# EAGLE design v2.0 Main (EAGLE 7.7.0)

## Sheet 1 of 2
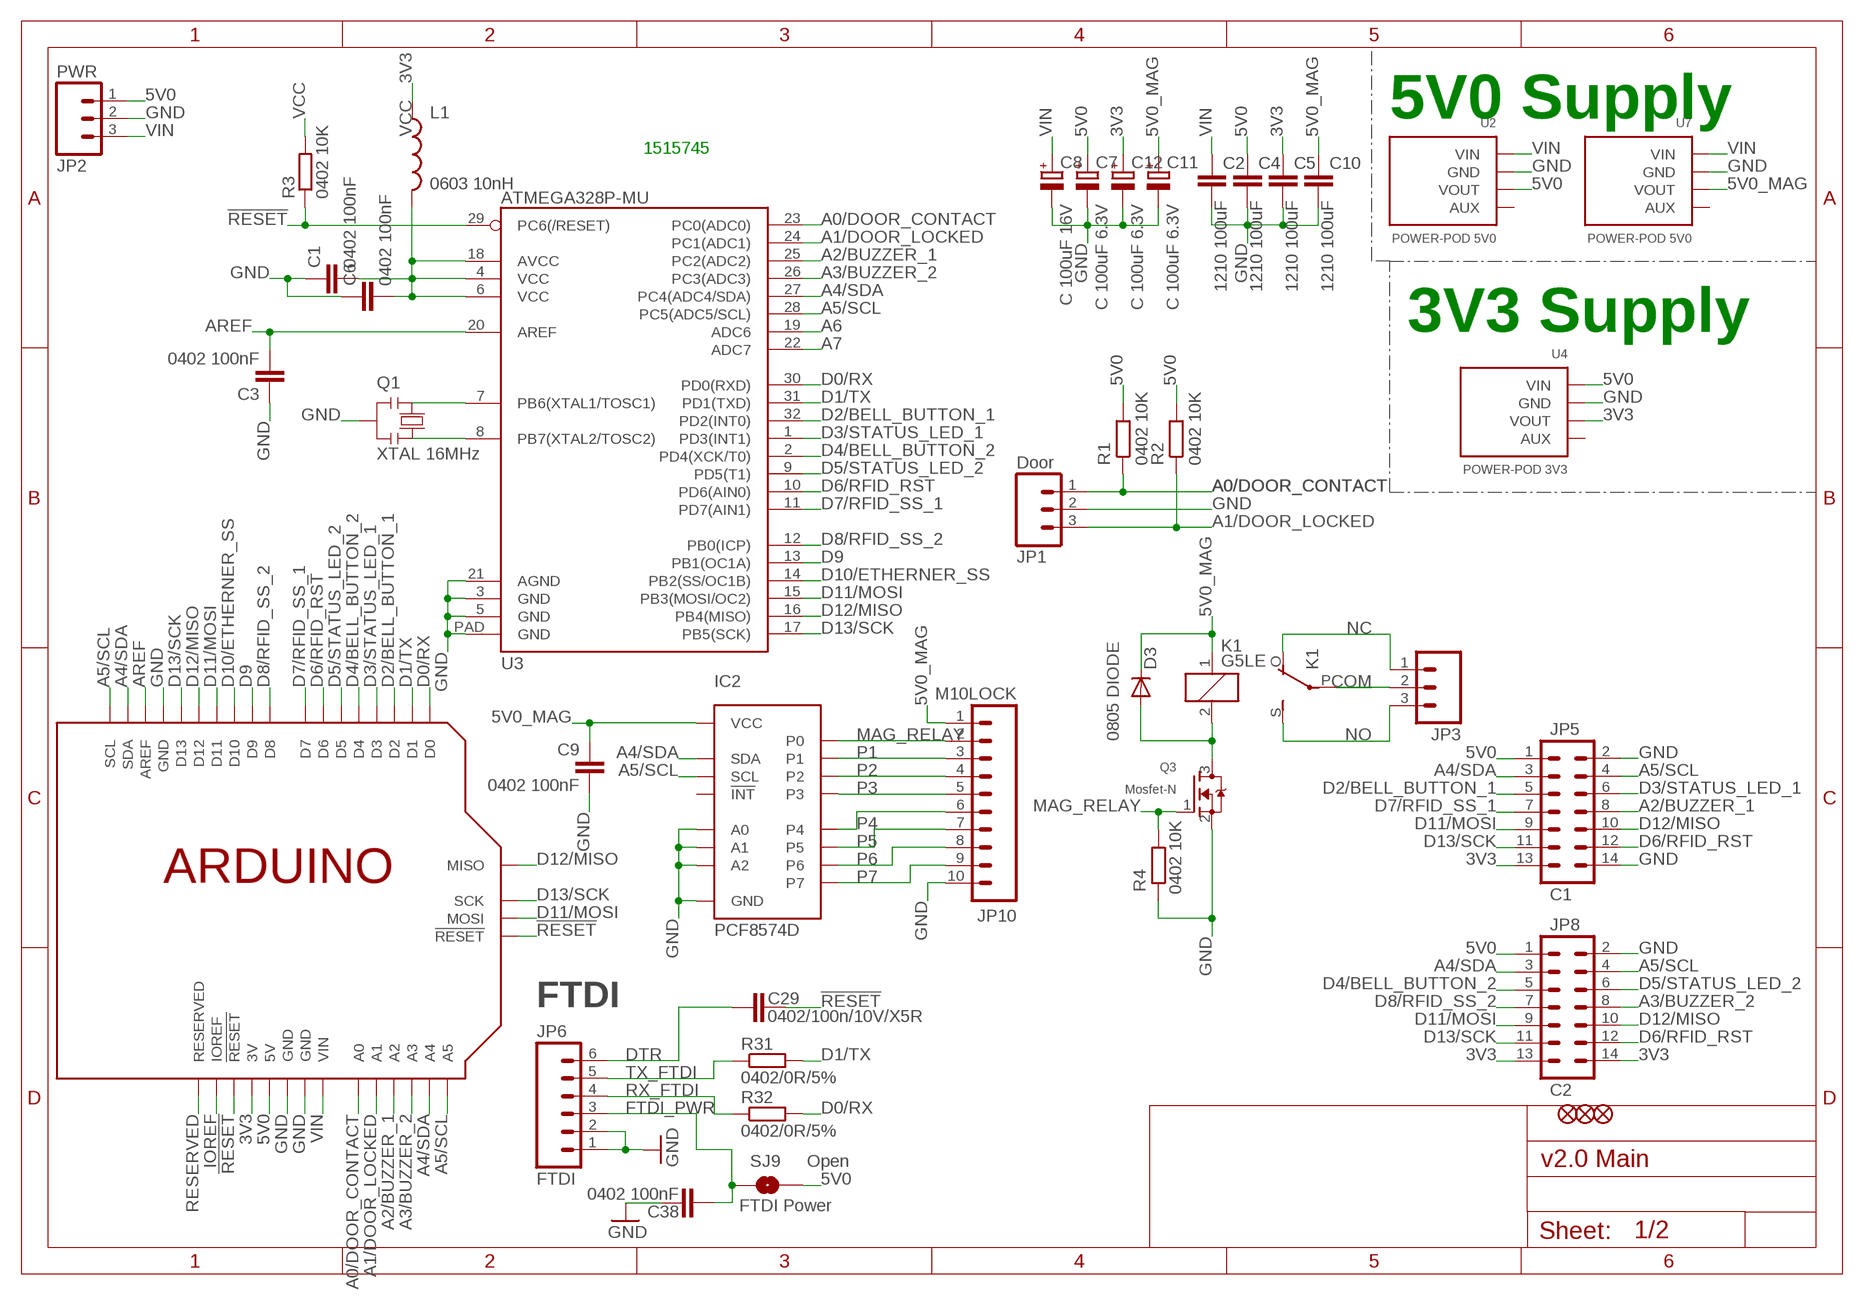
[diagram p0: schematic, sheet 1]

### Parts
C1  0402 100nF  C-EUC0402-SMALLER  [C0402-SMALLER]
C2  1210 100uF  C-EUC1210  [C1210]
C3  0402 100nF  C-EUC0402-SMALLER  [C0402-SMALLER]
C4  1210 100uF  C-EUC1210  [C1210]
C5  1210 100uF  C-EUC1210  [C1210]
C6  0402 100nF  C-EUC0402-SMALLER  [C0402-SMALLER]
C7  C 100uF 6.3V  CPOL-EUC  [PANASONIC_C]
C8  C 100uF 16V  CPOL-EUC  [PANASONIC_C]
C9  0402 100nF  C-EUC0402-SMALLER  [C0402-SMALLER]
C10  1210 100uF  C-EUC1210  [C1210]
C11  C 100uF 6.3V  CPOL-EUC  [PANASONIC_C]
C12  C 100uF 6.3V  CPOL-EUC  [PANASONIC_C]
C29  0402/100n/10V/X5R  C-EUC0402-ARDUINO-ROUND  [C0402-ARDUINO-ROUND]
C38  0402 100nF  C-EUC0402-SMALLER  [C0402-SMALLER]
D3  0805 DIODE  DIODE-0805  [0805-DIODE]
IC2  PCF8574D  PCF8574  [SO16]
JP1  Door  M03-SCREW-5MM  [SCREWTERMINAL-5MM-3]
JP2  PWR  M03-SCREW-5MM  [SCREWTERMINAL-5MM-3]
JP3  M03-SCREW-5MM  [SCREWTERMINAL-5MM-3]
JP4  FIDUCIAL1X2.5-STOP  [FIDUCIAL-1X2.5-STOP]
JP5  C1  M07X2-SHOROUDED_LOCK  [2X7-SHROUDED_LOCK]
JP6  FTDI  M06SIP  [1X06]
JP7  FIDUCIAL1X2.5-STOP  [FIDUCIAL-1X2.5-STOP]
JP8  C2  M07X2-SHOROUDED_LOCK  [2X7-SHROUDED_LOCK]
JP9  FIDUCIAL1X2.5-STOP  [FIDUCIAL-1X2.5-STOP]
JP10  M10LOCK  [1X10_LOCK]
K1  G5LE  G5LE-NO_TSOP-SMALL  [G5LE-NOSTOP-SMALL]
L1  0603 10nH  INDUCTOR0603K-SMALL  [C0603K-SMALL]
Q1  XTAL 16MHz  RESONATORMU  [RESONATOR]
Q3  Mosfet-N  MOSFET-N-SOT23-SPARK  [SOT23-3]
R1  0402 10K  R-EU_R0402-SMALLER  [R0402-SMALLER]
R2  0402 10K  R-EU_R0402-SMALLER  [R0402-SMALLER]
R3  0402 10K  R-EU_R0402-SMALLER  [R0402-SMALLER]
R4  0402 10K  R-EU_R0402-SMALLER  [R0402-SMALLER]
R31  0402/0R/5%  R-EU_R0402-ARDUINO-ROUND  [R0402-ARDUINO-ROUND]
R32  0402/0R/5%  R-EU_R0402-ARDUINO-ROUND  [R0402-ARDUINO-ROUND]
SJ9  FTDI Power  SOLDERJUMPERTRACE  [SJ_2S-TRACE]
U1  ARDUINOSPI-REFRENCE  [ARDUINOR3-LWKTXT-REF-SPI]
U2  POWER-POD 5V0  POWER-POD  [POWER-POD-LANDING]
U3  ATMEGA328P-MU  ATMEGA328-MLF-SHORT  [MLF32-SHORT-CREAM]
U4  POWER-POD 3V3  POWER-POD  [POWER-POD-LANDING]
U7  POWER-POD 5V0  POWER-POD  [POWER-POD-LANDING]

### Nets
3V3: C5.1 C12.+ JP5.13 JP8.13 JP8.14 L1.1 U1.3V U4.3(VOUT)
5V0: C4.1 C7.+ JP2.1 JP5.1 JP8.1 R1.2 R2.2 SJ9.2 U1.5V U1.5V@ISP(5V) U2.3(VOUT) U4.1(VIN)
5V0_MAG: C9.1 C10.1 C11.+ D3.C IC2.16(VCC) JP10.1 K1.1 U7.3(VOUT)
!RESET: C29.1 R3.1 U1.!RESET U1.!RESET@ISP(!RESET) U3.29(PC6(/RESET))
A0/DOOR_CONTACT: JP1.1 R1.1 U1.A0 U3.23(PC0(ADC0)) ; also sheet 2
A1/DOOR_LOCKED: JP1.3 R2.1 U1.A1 U3.24(PC1(ADC1)) ; also sheet 2
A2/BUZZER_1: JP5.8 U1.A2 U3.25(PC2(ADC2))
A3/BUZZER_2: JP8.8 U1.A3 U3.26(PC3(ADC3))
A4/SDA: IC2.15(SDA) JP5.3 JP8.3 U1.A4 U1.SDA U3.27(PC4(ADC4/SDA))
A5/SCL: IC2.14(SCL) JP5.4 JP8.4 U1.A5 U1.SCL U3.28(PC5(ADC5/SCL))
A6: U3.19(ADC6)
A7: U3.22(ADC7)
AREF: C3.2 U1.AREF U3.20(AREF)
COM: JP3.2 K1.P(2:P)
D0/RX: R32.2 U1.D0 U3.30(PD0(RXD))
D1/TX: R31.2 U1.D1 U3.31(PD1(TXD))
D2/BELL_BUTTON_1: JP5.5 U1.D2 U3.32(PD2(INT0))
D3/STATUS_LED_1: JP5.6 U1.D3 U3.1(PD3(INT1))
D4/BELL_BUTTON_2: JP8.5 U1.D4 U3.2(PD4(XCK/T0))
D5/STATUS_LED_2: JP8.6 U1.D5 U3.9(PD5(T1))
D6/RFID_RST: JP5.12 JP8.12 U1.D6 U3.10(PD6(AIN0))
D7/RFID_SS_1: JP5.7 U1.D7 U3.11(PD7(AIN1))
D8/RFID_SS_2: JP8.7 U1.D8 U3.12(PB0(ICP))
D9: U1.D9 U3.13(PB1(OC1A))
D10/ETHERNER_SS: U1.D10 U3.14(PB2(SS/OC1B))
D11/MOSI: JP5.9 JP8.9 U1.D11 U1.MOSI U3.15(PB3(MOSI/OC2))
D12/MISO: JP5.10 JP8.10 U1.D12 U1.MISO U3.16(PB4(MISO))
D13/SCK: JP5.11 JP8.11 U1.D13 U1.SCK U3.17(PB5(SCK))
DTR: C29.2 JP6.6
FTDI_PWR: C38.2 JP6.3 SJ9.1
GND: C1.1 C2.2 C3.1 C4.2 C5.2 C6.1 C7.- C8.- C9.2 C10.2 C11.- C12.- C38.1 IC2.1(A0) IC2.2(A1) IC2.3(A2) IC2.8(GND) JP1.2 JP2.2 JP5.2 JP5.14 JP6.1 JP6.2 JP8.2 JP10.10 Q1.2 Q3.2(S) R4.1 U1.GND@1(GND) U1.GND@2(GND) U1.GND@3(GND) U1.GND@ISP(GND) U2.2(GND) U3.3(GND) U3.5(GND) U3.21(AGND) U3.PAD(GND) U4.2(GND) U7.2(GND) ; also sheet 2
IOREF: U1.IOREF
MAG_RELAY: IC2.4(P0) JP10.2 Q3.1(G) R4.2
N$2: D3.A K1.2 Q3.3(D)
N$3: Q1.1 U3.7(PB6(XTAL1/TOSC1))
N$4: Q1.3 U3.8(PB7(XTAL2/TOSC2))
NC: JP3.1 K1.O(2:O)
NO: JP3.3 K1.S(2:S)
P1: IC2.5(P1) JP10.3
P2: IC2.6(P2) JP10.4
P3: IC2.7(P3) JP10.5
P4: IC2.9(P4) JP10.6
P5: IC2.10(P5) JP10.7
P6: IC2.11(P6) JP10.8
P7: IC2.12(P7) JP10.9
RESERVED: U1.RESERVED
RX_FTDI: JP6.4 R32.1
TX_FTDI: JP6.5 R31.1
VCC: C1.2 C6.2 L1.2 R3.2 U3.4(VCC) U3.6(VCC) U3.18(AVCC)
VIN: C2.1 C8.+ JP2.3 U1.VIN U2.1(VIN) U7.1(VIN)
Unconnected: IC2.13(!INT) U2.4(AUX) U4.4(AUX) U7.4(AUX)

### Notes on the sheet
- 5V0 Supply
- 1515745
- 3V3 Supply
- FTDI
- Open

## Sheet 2 of 2
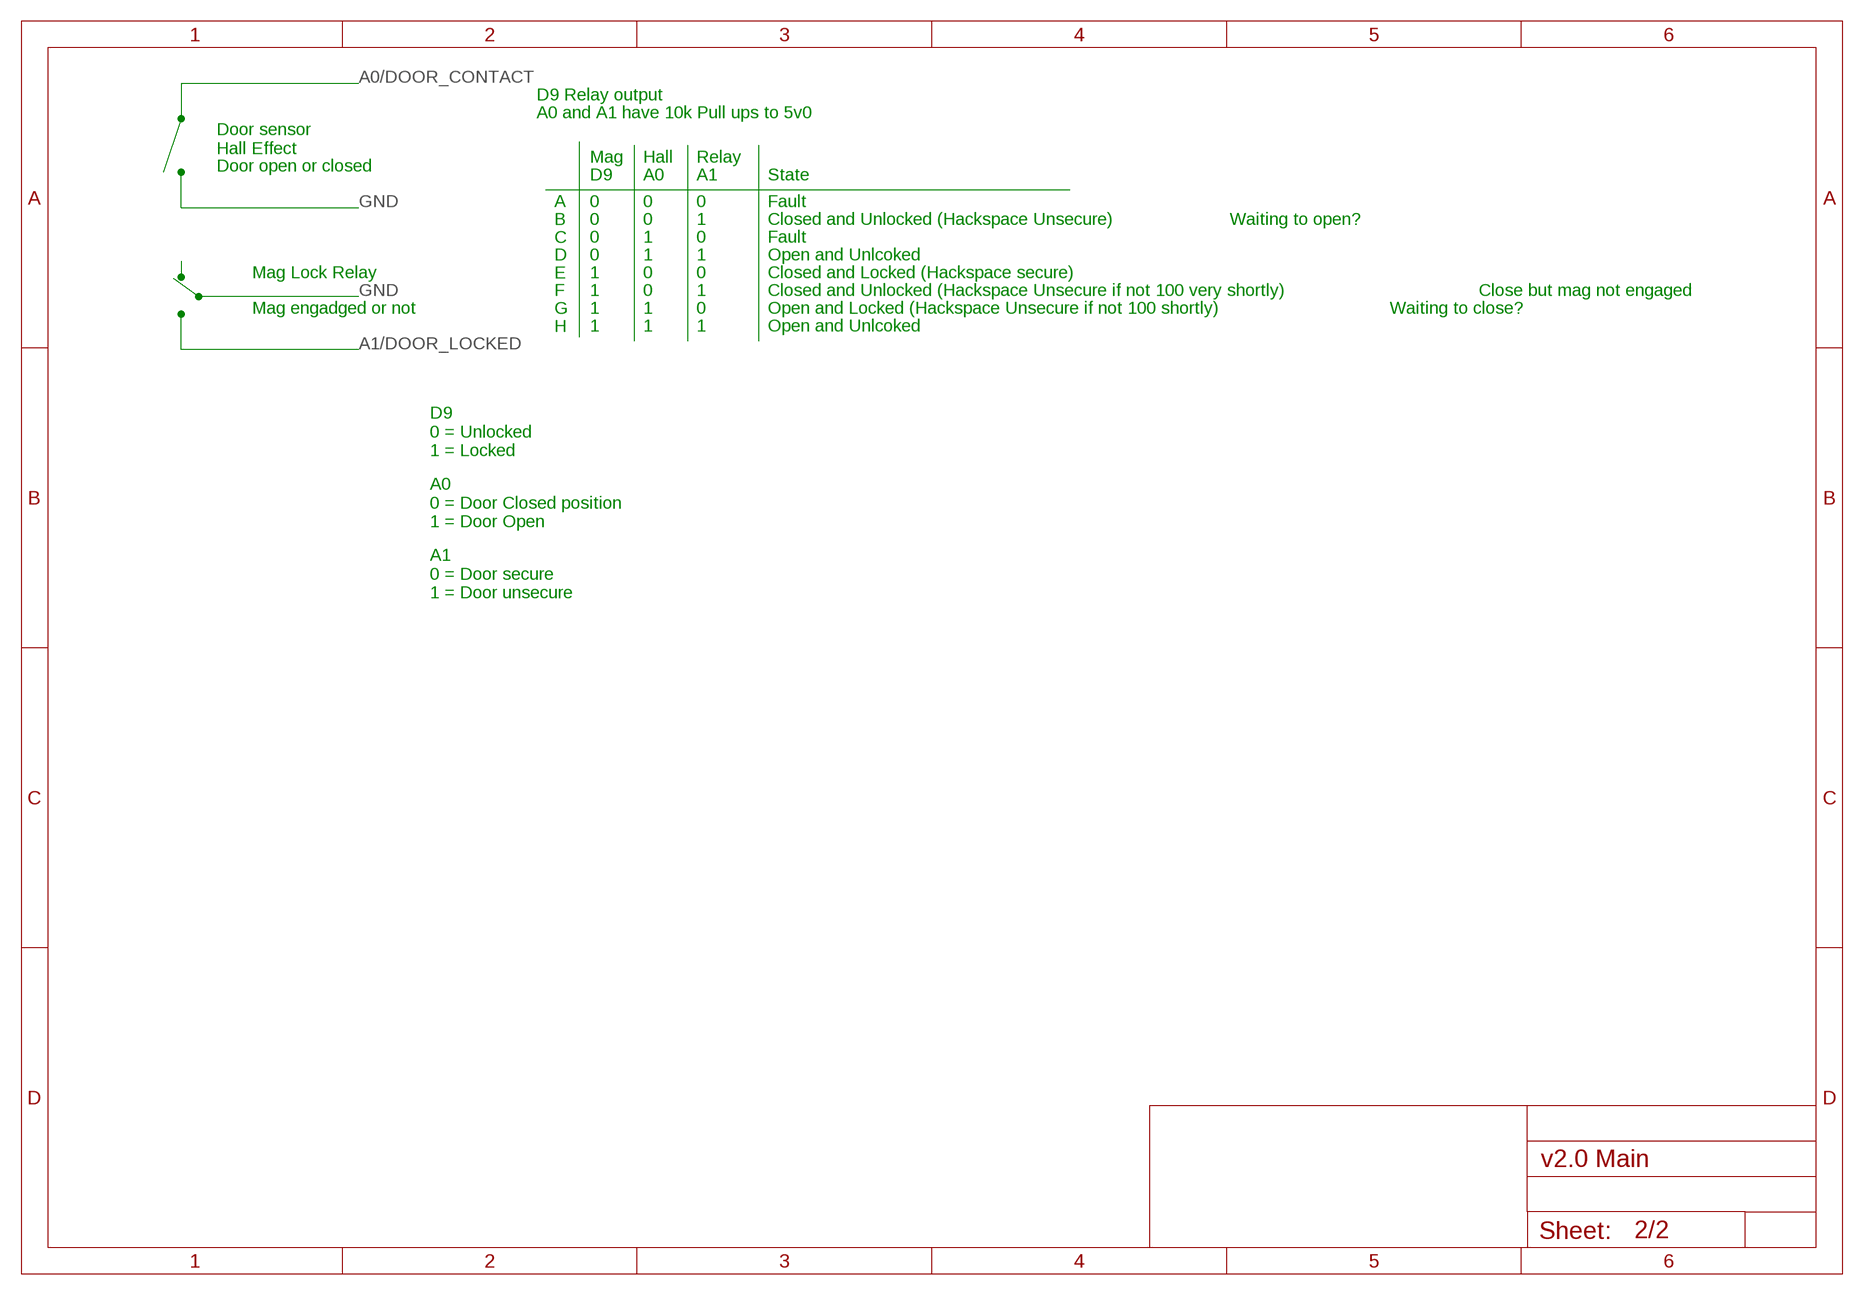
[diagram p1: schematic, sheet 2]

### Notes on the sheet
- D9 Relay output
- A0 and A1 have 10k Pull ups to 5v0
- Door sensor
  Hall Effect
- Mag | Hall | Relay
- Door open or closed
- D9 | A0 | A1 | State
- 0 | 0 | 0 | Fault
- 0 | 0 | 1 | Closed and Unlocked (Hackspace Unsecure) | Waiting to open?
- 0 | 1 | 0 | Fault
- 0 | 1 | 1 | Open and Unlcoked
- Mag Lock Relay | 1 | 0 | 0 | Closed and Locked (Hackspace secure)
- 1 | 0 | 1 | Closed and Unlocked (Hackspace Unsecure if not 100 very shortly) | Close but mag not engaged
- Mag engadged or not | 1 | 1 | 0 | Open and Locked (Hackspace Unsecure if not 100 shortly) | Waiting to close?
- A
  B
  C
  D
  E
  F
  G
  H
- 1 | 1 | 1 | Open and Unlcoked
- D9
  0 = Unlocked
  1 = Locked
- A0
  0 = Door Closed position
  1 = Door Open
- A1
  0 = Door secure
  1 = Door unsecure

## Library data of the parts
C1-C6 C9 C10 = CISECO eaglecad designs:C-EU: CAPACITOR, European symbol
C7 C8 C11 C12 = rcl:CPOL-EU: POLARIZED CAPACITOR, European symbol
C29 C38 = TiLDA Mk2 Parts:C-EU: CAPACITOR, European symbol
D3 = CISECO eaglecad designs:DIODE-: DIODE
IC2 = CISECO eaglecad designs:PCF8574
JP1-JP3 = CISECO eaglecad designs:M03: Header 3 Standard 3-pin 0.1" header. Use with straight break away headers (SKU : PRT-00116), right angle break away headers (PRT-00553), swiss pins (PRT-00743), machine pins (PRT-00117), and female headers (PRT-00115). Molex polarized connector foot print use with SKU : PRT-08232 with associated crimp pins and housings.
JP4 JP7 JP9 = CISECO eaglecad designs:FIDUCIAL: Fiducial Alignment Points Various fiducial points for machine vision alignment.
JP5 JP8 = CISECO eaglecad designs:M07X2
JP6 = TiLDA Mk2 Parts:M06: Header 6 Standard 6-pin 0.1" header. Use with straight break away headers (SKU : PRT-00116), right angle break away headers (PRT-00553), swiss pins (PRT-00743), machine pins (PRT-00117), and female headers (PRT-00115). Molex polarized connector foot print use with SKU : PRT-08094 with associated crimp pins and housings. NOTES ON THE VARIANTS LOCK and LOCK_LONGPADS... This footprint was designed to help hold the alignment of a through-hole component (i.e. 6-pin header) while soldering it into place. You may notice that each hole has been shifted either up or down by 0.005 of an inch from it's more standard position (which is a perfectly straight line). This slight alteration caused the pins (the squares in the middle) to touch the edges of the holes. Because they are alternating, it causes a "brace" to hold the component in place. 0.005 has proven to be the perfect amount of "off-center" position when using our standard breakaway headers. Although looks a little odd when you look at the bare footprint, once you have a header in there, the alteration is very hard to notice. Also, if you push a header all the way into place, it is covered up entirely on the bottom side. This idea of altering the position of holes to aid alignment will be further integrated into the Sparkfun Library for other footprints. It can help hold any component with 3 or more connection pins.
JP10 = CISECO eaglecad designs:M10: Header 10 Standard 10-pin 0.1" header. Use with straight break away headers (SKU : PRT-00116), right angle break away headers (PRT-00553), swiss pins (PRT-00743), machine pins (PRT-00117), and female headers (PRT-00115).
K1 = CISECO eaglecad designs:G5LE: RELAY 1 x switch, 10 A/120 V AC, 8 A/30 V DC, Omron
L1 = CISECO eaglecad designs:INDUCTOR: Inductors Basic Inductor/Choke - 0603 and 1206. Footprints are not proven and vary greatly between part numbers.
Q1 = MySMD2:RESONATOR
Q3 = TiLDA Mk2 Parts:MOSFET-N: N-Channel Mosfet 2N7002E - 60V 260mA SOT23 [Digikey: 2N7002ET1GOSTR-ND] - REEL BSH103 - 30V 850mA SOT23 [Digikey: 568-5013-1-ND]
R1-R4 = CISECO eaglecad designs:R-EU_: RESISTOR, European symbol
R31 R32 = TiLDA Mk2 Parts:R-EU_: RESISTOR, European symbol
SJ9 = TiLDA Mk2 Parts:SOLDERJUMPER: Solder Jumper Standard SMD solder jumper. Used to automate production. Two varients : Normally Open and Normally Closed are the same, but have different paste layers. NC will have a large amount of paste and should jumper during reflow.
U1 = CISECO eaglecad designs:ARDUINOSPI
U2 U4 U7 = Ciseco Footprints:POWER-POD
U3 = CISECO eaglecad designs:ATMEGA328-MLF

## Net classes
2 MAINS: clearance 4 mm

## Board
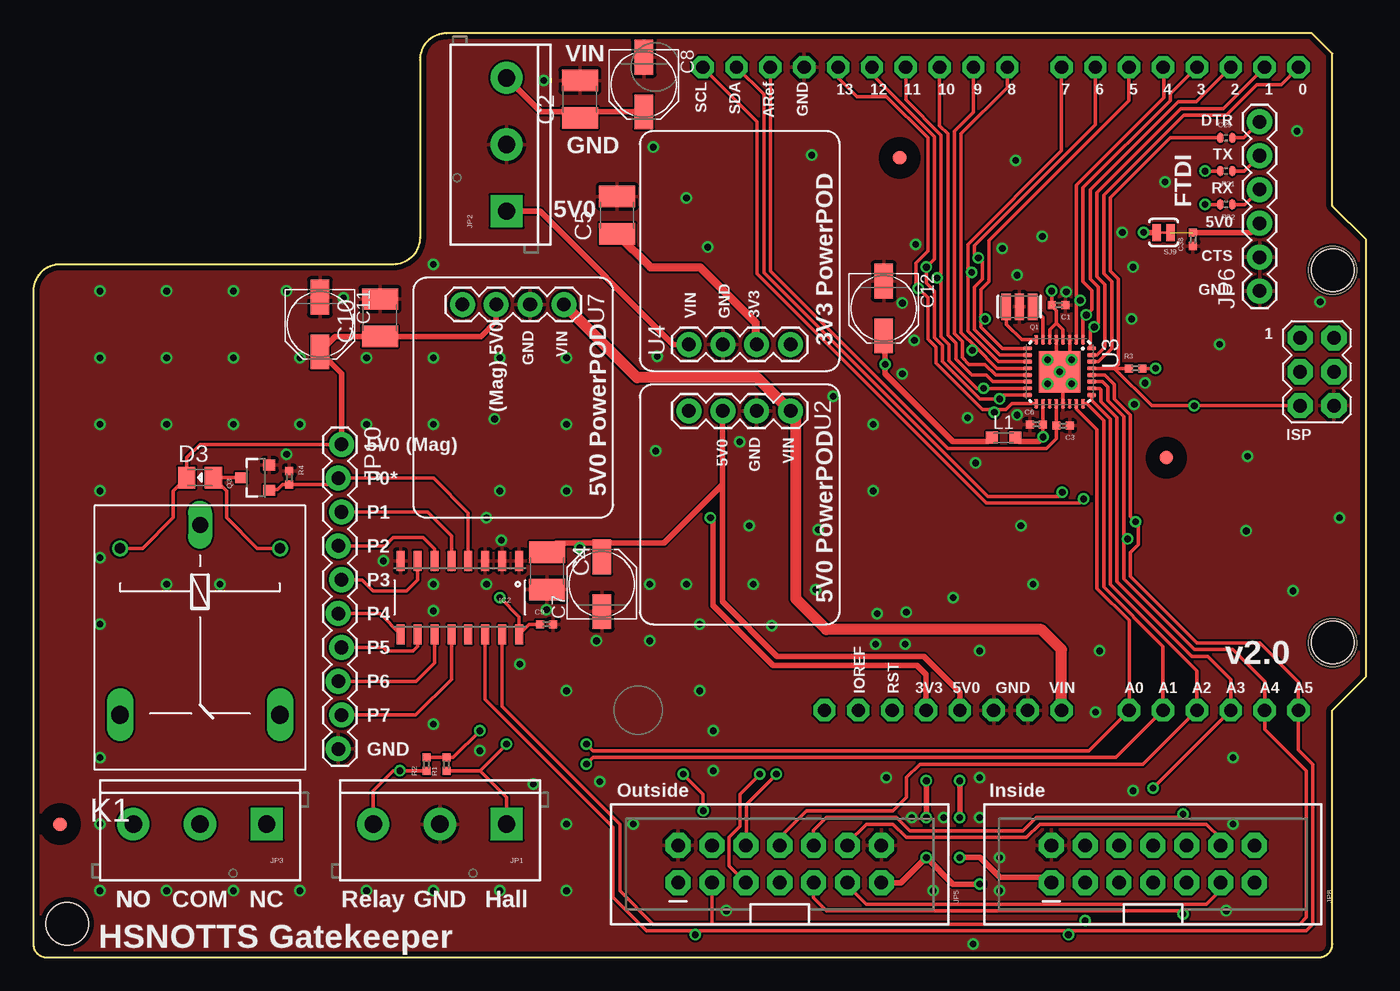
[diagram p2: board, top side]
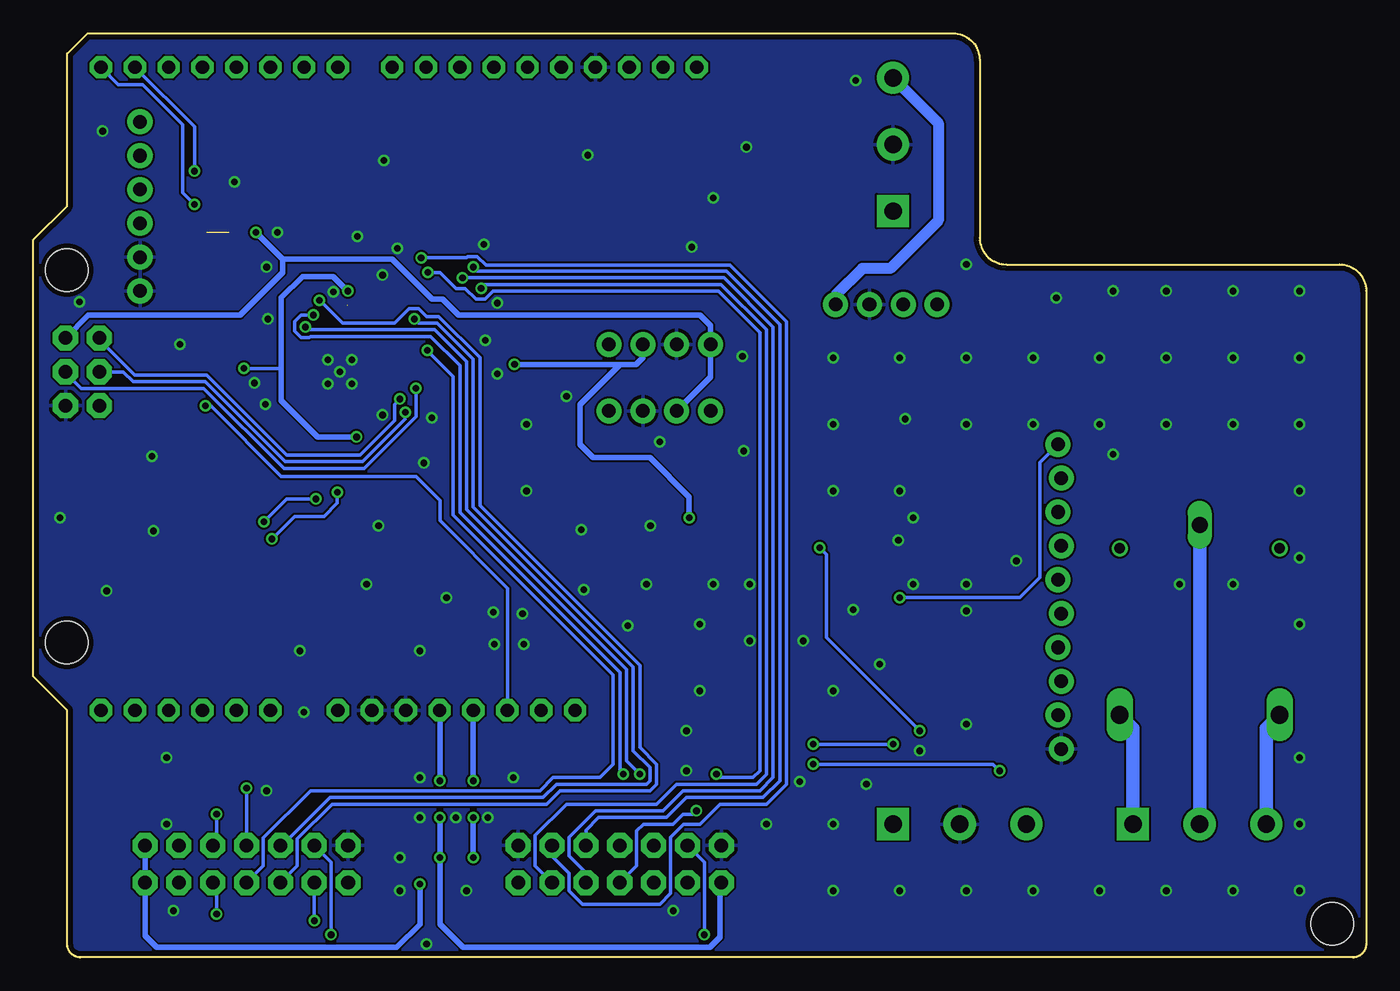
[diagram p3: board, bottom side, seen from below]

Size 100 x 69.34 mm. Coordinates in mm from the lower left corner, seen from the top.
Outline: 95.94,69.34 31,69.34 arc90 29,67.34 29,54 arc-90 27,52 2,52 arc90 0,50 0,1 arc90 1,0 96.46,0 arc90 97.46,1 97.46,18.54 100,21.08 100,53.85 97.46,56.39 97.46,67.82 95.94,69.34
Copper layers (1*16): Top 0.0356mm / dielectric 1.5011mm / Bottom 0.0356mm
Design rules "default *": minimum track width 6mil, minimum drill 13mil, track to track 6mil, track to pad 6mil, pad to pad 6mil, via to via 6mil, smd to smd 6mil, copper to edge 15mil, drill to drill 6mil, minimum pad ring 7mil, minimum via ring 7mil, stop-mask expansion 3mil, vias tented up to drill 23mil, thermal gap 10mil
Holes 3.2 mm at 2.54,2.54 97.48,51.56 97.48,23.62

### Footprints (pad centres in the part's own frame; a part is rotated, then mirrored left to right if it is on the bottom)
C0402-SMALLER = smd 0.6 x 0.6: 1 -0.5,0; 2 0.5,0
C1210 = smd 1.6 x 2.7: 1 -1.4,0; 2 1.4,0
PANASONIC_C = smd 2.6 x 1.4: + 2.05,0; - -2.05,0
C0402-ARDUINO-ROUND = smd 0.508 x 0.762: 1 -0.445,0; 2 0.445,0
0805-DIODE = smd 1.3 x 1.6: A 1,0; C -1,0
SO16 = smd 0.6 x 1.5: 1 -4.445,-2.75; 2 -3.175,-2.75; 3 -1.905,-2.75; 4 -0.635,-2.75; 5 0.635,-2.75; 6 1.905,-2.75; 7 3.175,-2.75; 8 4.445,-2.75; 9 4.445,2.75; 10 3.175,2.75; 11 1.905,2.75; 12 0.635,2.75; 13 -0.635,2.75; 14 -1.905,2.75; 15 -3.175,2.75; 16 -4.445,2.75
SCREWTERMINAL-5MM-3 = drill 1.3 pad 2.413 square: 1 0,0 | drill 1.3 pad 2.413: 2 5,0; 3 10,0
FIDUCIAL-1X2.5-STOP = smd 1 x 1: 1 0,0
2X7-SHROUDED_LOCK = drill 1.016 pad 1.88 octagon: 1 -7.62,-1.397; 2 -7.62,1.397; 3 -5.08,-1.397; 4 -5.08,1.397; 5 -2.54,-1.397; 6 -2.54,1.397; 7 0,-1.397; 8 0,1.397; 9 2.54,-1.397; 10 2.54,1.397; 11 5.08,-1.397; 12 5.08,1.397; 13 7.62,-1.397; 14 7.62,1.397
1X06 = drill 1.016 pad 1.88: 1 0,0; 2 2.54,0; 3 5.08,0; 4 7.62,0; 5 10.16,0; 6 12.7,0
1X10_LOCK = drill 1.016 pad 1.88: 1 0,0.127; 2 2.54,-0.127; 3 5.08,0.127; 4 7.62,-0.127; 5 10.16,0.127; 6 12.7,-0.127; 7 15.24,0.127; 8 17.78,-0.127; 9 20.32,0.127; 10 22.86,-0.127
G5LE-NOSTOP-SMALL = drill 0.8: 1 -7.7,-6; 2 -7.7,6 | drill 1.321 long: O 4.8,6; S 4.8,-6 | drill 1.2 long: P -9.45,0
C0603K-SMALL = smd 0.889 x 0.889: 1 -0.875,0; 2 0.875,0
RESONATOR = smd 0.7 x 2: 1 -1,0; 2 0,0; 3 1,0
SOT23-3 = smd 0.8 x 0.9: 1 -0.95,-1; 2 0.95,-1; 3 0,1.1
R0402-SMALLER = smd 0.6 x 0.6: 1 -0.5,0; 2 0.5,0
R0402-ARDUINO-ROUND = smd 0.508 x 0.762: 1 -0.445,0; 2 0.445,0
SJ_2S-TRACE = smd 0.635 x 1.27: 1 -0.508,0; 2 0.508,0
ARDUINOR3-LWKTXT-REF-SPI = drill 1 pad 1.676 octagon: 3V 35.56,2.54; 5V 38.1,2.54; !RESET 33.02,2.54; A0 50.8,2.54; A1 53.34,2.54; A2 55.88,2.54; A3 58.42,2.54; A4 60.96,2.54; A5 63.5,2.54; AREF 23.876,50.8; D0 63.5,50.8; D1 60.96,50.8; D2 58.42,50.8; D3 55.88,50.8; D4 53.34,50.8; D5 50.8,50.8; D6 48.26,50.8; D7 45.72,50.8; D8 41.656,50.8; D9 39.116,50.8; D10 36.576,50.8; D11 34.036,50.8; D12 31.496,50.8; D13 28.956,50.8; GND@1 43.18,2.54; GND@2 40.64,2.54; GND@3 26.416,50.8; IOREF 30.48,2.54; RESERVED 27.94,2.54; SCL 18.796,50.8; SDA 21.336,50.8; VIN 45.72,2.54 | drill 1.016 pad 1.88 octagon: 5V@ISP 66.167,30.48; !RESET@ISP 63.627,25.4; GND@ISP 66.167,25.4; MISO 63.627,30.48; MOSI 66.167,27.94; SCK 63.627,27.94
POWER-POD-LANDING = drill 1.016 pad 1.88: 1 -3.81,0; 2 -1.27,0; 3 1.27,0; 4 3.81,0
MLF32-SHORT-CREAM = smd 0.7 x 0.28: 1 -2.4,1.75; 2 -2.4,1.25; 3 -2.4,0.75; 4 -2.4,0.25; 5 -2.4,-0.25; 6 -2.4,-0.75; 7 -2.4,-1.25; 8 -2.4,-1.75; 17 2.4,-1.75; 18 2.4,-1.25; 19 2.4,-0.75; 20 2.4,-0.25; 21 2.4,0.25; 22 2.4,0.75; 23 2.4,1.25; 24 2.4,1.75 | smd 0.28 x 0.7: 9 -1.75,-2.4; 10 -1.25,-2.4; 11 -0.75,-2.4; 12 -0.25,-2.4; 13 0.25,-2.4; 14 0.75,-2.4; 15 1.25,-2.4; 16 1.75,-2.4; 25 1.75,2.4; 26 1.25,2.4; 27 0.75,2.4; 28 0.25,2.4; 29 -0.25,2.4; 30 -0.75,2.4; 31 -1.25,2.4; 32 -1.75,2.4 | smd 3.1 x 3.1: PAD 0,0

### Placement (x,y rotation side)
C1  76.93,48.94 180 top
C2  41,64.4 90 top
C3  77.25,39.9 180 top
C4  38.55,29 270 top
C5  43.8,55.7 90 top
C6  75.25,40 0 top
C7  42.65,28 90 top
C8  45.8,65.5 270 top
C9  38.5,25 0 top
C10  26,48 90 top
C11  21.5,47.5 270 top
C12  63.8,48.7 270 top
C29  89.5,61.5 0 top
C38  87,53.88 90 top
D3  12.5,36 0 top
IC2  32,27 180 top
JP1  35.5,10 180 top
JP2  35.5,56 90 top
JP3  17.5,10 180 top
JP4  2,10 0 top
JP5  56,7 0 top
JP6  92,50 90 top
JP7  65,60 0 top
JP8  84,7 0 top
JP9  85,37.5 0 top
JP10  23,38.5 270 top
K1  12.5,23 270 top
L1  72.8,39 0 top
Q1  73.98,48.83 180 top
Q3  16.7,36 90 top
R1  31,14.5 90 top
R2  29.5,14.5 90 top
R3  82.7,44.2 0 top
R4  19.2,36 270 top
R31  89.5,59 180 top
R32  89.5,56.5 180 top
SJ9  84.8,54.4 180 top
U1  31.42,16 0 top
U2  53,41 180 top
U3  77,43.95 270 top
U4  53,46 0 top
U7  36,49 180 top

### Tracks (layer width: path | path; a pad name or v marks a point on that pad's centre or on a via)
3V3  (via drill 0.5)
  Top 0.406: U1.3V 66.98,21.22 66.3,21.9 55.5,21.9 51,26.4 51,32.8 v50.8,33 | C12.+ 63.9,46.65 v63.9,44.5 63.9,43.8 69,38.7 71.62,38.7 L1.1 | v67,13.25 v67,10.5 | JP5.13 65.1,5.6 65.65,6.15 65.23,5.73 v67,7.5 69,5.5 v71,5.5
  Top 0.61: U4.3 54.2,46.07 54.2,47.6 50.02,51.78 46.3,51.78 43.8,54.28 C5.1
  Bottom 0.406: v50.8,33 50.8,34.55 53.75,37.5 58,37.5 59,38.5 59,41.5 56,44.5 | U4.3 54.27,45 54.77,44.5 56,44.5 | 56,44.5 v63.9,44.5 | U1.3V 67,18.52 v67,13.25 | v67,10.5 v67,7.5 | v71,5.5 71,2.5 72.75,0.75 90.75,0.75 91.62,1.62 JP8.13 JP8.14
5V0  (via drill 0.5)
  Top 0.254: R2.2 R1.2 31.5,15 v33.5,17 | v41,30.75 41,31.1
  Top 0.406: U1.5V 69.52,19.88 66.8,22.6 55.8,22.6 51.7,26.7 51.7,35.5 | 51.7,35.5 51.7,41 U2.3 | 42.65,31.1 41,31.1 39.25,31.1 C4.1 | 42.65,31.1 47.3,31.1 51.7,35.5 | v83.3,54.4 SJ9.2 | C7.+ 42.65,31.1 | JP2.1 38,56 48,46 U4.1 | v69.5,13.25 v69.5,10.5 | JP8.1 75.98,6 72.5,6 71,7.5 v69.5,7.5
  Bottom 0.254: v33.5,17 40.5,24 40.5,30.25 v41,30.75
  Bottom 0.406: U2.3 49.19,43.54 U4.1 49.2,47.4 50,48.2 68.1,48.2 69.3,49.4 70.1,49.4 73.1,52.4 81.3,52.4 | U1.5V@ISP 95.87,48.2 84.5,48.2 81.3,51.4 81.3,52.4 | 81.3,52.4 v83.3,54.4 | U1.5V 69.5,18.52 v69.5,13.25 | v69.5,10.5 v69.5,7.5 69.5,2.5 67.75,0.75 49.25,0.75 48.5,1.5 48.5,5.48 JP5.1
5V0_MAG  (via drill 0.5)
  Top 0.254: K1.1 8.2,30.7 10.5,33 10.5,35 D3.C 11.5,37.5 12.5,38.5 JP10.1 | v35,27 36.45,25.55 IC2.16 37.2,25 C9.1
  Top 0.406: U7.3 34.73,47.73 33.6,46.6 C10.1 22.65,46.6 C11.+ 23.13,43.82 JP10.1
  Bottom 0.254: v35,27 26,27 24.5,28.5 24.5,37.13 JP10.1
!RESET  (via drill 0.5)
  Top 0.254: C29.1 85.3,61.5 80.8,57 80.8,51.5 81.4,50.9 81.4,44.5 81.1,44.2 | 81.1,44.2 R3.1 | 81.1,44.2 U3.29 | U1.!RESET@ISP v87.1,41.4 83.9,41.4 81.1,44.2
  Bottom 0.254: U1.!RESET 64.4,18.58 64.4,27.7 69.5,32.8 69.5,34.3 71.3,36.1 81.4,36.1 86.7,41.4 v87.1,41.4
A0/DOOR_CONTACT  (via drill 0.5)
  Top 0.254: U3.23 78.25,41.15 79.8,39.6 79.8,27.7 82.22,25.28 U1.A0 79.18,15.5 42,15.5 v41.5,16 | JP1.1 35.5,12 33.5,14 | 33.5,14 R1.1 | v35.5,16 33.5,14
  Bottom 0.254: v41.5,16 v35.5,16
A1/DOOR_LOCKED  (via drill 0.5)
  Top 0.254: U3.24 79.05,41.55 80.3,40.3 80.3,27.8 84.76,23.34 U1.A1 81.22,15 42,15 v41.5,14.5 | JP1.3 25.5,12.5 27,14 v27.5,14 R2.1
  Bottom 0.254: v41.5,14.5 28,14.5 v27.5,14
A2/BUZZER_1
  Top 0.254: U3.25 79.4,41.8 80.8,40.4 80.8,28 87.3,21.5 U1.A2 83.26,14.5 66.5,14.5 65.5,13.5 65.5,12 64.5,11 58,11 56,9 JP5.8
A3/BUZZER_2  (via drill 0.5)
  Top 0.254: U3.26 80,42.7 80.1,42.6 80.1,41.7 81.3,40.5 81.3,28.2 86.9,22.6 88.1,22.6 89.84,20.86 U1.A3 v84,12.7
  Bottom 0.254: v84,12.7 JP8.8
A4/SDA  (via drill 0.5)
  Top 0.254: 81.8,31.4 81.8,40.6 80.6,41.8 80.6,42.8 80.2,43.2 U3.27 | 81.8,31.4 81.8,28.4 87.1,23.1 90,23.1 92.38,20.72 U1.A4 92.38,17.12 95.5,14 95.5,3 95,2.5 78.92,2.5 | v82.1,31.4 81.8,31.4 | U1.SDA 54.8,64.76 54.8,51.4 71.6,34.6 76.9,34.6 v77.2,34.9 | IC2.15 35.17,18.82 44,10 44,5 46.5,2.5 50.93,2.5 | 78.92,2.5 50.93,2.5 | v78.92,2.75 78.92,2.5 | JP5.3 50.92,2.51 50.93,2.5
  Bottom 0.254: v77.2,34.9 77.2,34.1 78.2,33.1 80.4,33.1 v82.1,31.4 | JP8.3 v78.92,2.75
A5/SCL  (via drill 0.5)
  Top 0.254: U3.28 80.4,43.7 81.1,43 81.1,41.9 82.3,40.7 82.3,33.1 v82.7,32.7 82.9,32.5 82.9,31 82.3,30.4 82.3,28.6 87.3,23.6 92,23.6 94.92,20.68 U1.A5 94.92,15.58 96,14.5 96,2.5 95.5,2 77.66,2 | U1.SCL 54.3,62.72 54.3,51.3 71.5,34.1 78.5,34.1 v78.8,34.4 | IC2.14 33.91,19.34 43.5,9.75 43.5,4.5 46,2 49.66,2 | 77.66,2 49.66,2 | v49.66,1.7 49.66,2 | v77.66,1.7 77.66,2
  Bottom 0.254: v78.8,34.4 81,34.4 v82.7,32.7 | JP5.4 49.66,7.13 49.66,6.73 49.66,7.01 v49.66,1.7 | JP8.4 77.66,7.14 77.66,5.52 77.66,7.01 v77.66,1.7
AREF
  Top 0.254: U1.AREF 55.3,51.5 68.6,38.2 76,38.2 76.75,38.95 C3.2 U3.20
COM
  Bottom 1.016: K1.P JP3.2
D0/RX  (via drill 0.5)
  Top 0.254: U1.D0 93.62,65.5 91.8,65.5 89.5,63.2 86.3,63.2 80.3,57.2 80.3,51.3 80.9,50.7 80.9,45.7 79.9,44.7 U3.30 | R32.2 v87.9,56.5
  Bottom 0.254: v87.9,56.5 88.8,57.4 88.8,62.5 91.8,65.5 93.62,65.5 U1.D0
D1/TX  (via drill 0.5)
  Top 0.254: U1.D1 89.28,63.7 86.1,63.7 79.8,57.4 79.8,51.1 80.4,50.5 80.4,45.8 79.8,45.2 U3.31 | R31.2 v87.9,59
  Bottom 0.254: v87.9,59 87.9,62.32 U1.D1
D2/BELL_BUTTON_1  (via drill 0.5)
  Top 0.254: U1.D2 87.24,64.2 85.9,64.2 79.3,57.6 79.3,50.9 79.9,50.3 79.9,47.6 v79.6,47.3 79.3,47.3 79.3,45.8 U3.32 | JP5.5 52.2,6.87 52.2,7.37 52.2,6.99 52.2,9.02 53,9.82 53,12.25 v54.5,13.75
  Bottom 0.254: v79.6,47.3 79.4,47.1 69.9,47.1 67.5,44.7 67.5,33.6 55.5,21.6 55.5,14.75 v54.5,13.75
D3/STATUS_LED_1  (via drill 0.5)
  Top 0.254: U3.1 78.75,48.2 v79,48.2 79.4,48.6 79.4,50.05 78.75,50.7 78.75,57.75 85.3,64.3 85.3,64.8 U1.D3 | v55.75,13.75 53.5,11.5 53.5,8.44 JP5.6
  Bottom 0.254: v79,48.2 79.9,48.2 80.4,47.7 80.4,47 79.9,46.5 79.3,46.5 79.2,46.6 70.2,46.6 68,44.4 68,33.4 56,21.4 56,14 v55.75,13.75
D4/BELL_BUTTON_2  (via drill 0.5)
  Top 0.254: U1.D4 84.8,66.76 84.8,64.5 78.25,57.95 78.25,49.3 | U3.2 78.25,49.3 | 78.25,49.3 v78.55,49.3
  Bottom 0.254: v78.55,49.3 78.5,49.3 76.8,47.6 72.9,47.6 71.8,48.7 71.1,48.7 70.5,48.1 69.6,48.1 66.5,45 66.5,33.9 54.5,21.9 54.5,15.75 53.25,14.5 53.25,13 53.75,12.5 60.5,12.5 61.5,11.5 77.59,11.5 80.2,8.89 80.2,6.99 80.2,7.81 80.2,6.86 JP8.5
D5/STATUS_LED_2  (via drill 0.5)
  Top 0.254: 71.1,47.9 71.1,47.3 72.7,45.7 U3.9 | 71.1,47.9 71.1,50.1 71.7,50.7 71.7,53.8 82.2,64.3 82.2,66.78 U1.D5 | v71.4,47.9 71.1,47.9
  Bottom 0.254: v71.4,47.9 71.1,47.6 69.7,47.6 67,44.9 67,33.8 55,21.8 55,15.5 53.75,14.25 53.75,13.25 54,13 60.75,13 61.75,12 77.73,12 81.33,8.4 JP8.6
D6/RFID_RST  (via drill 0.5)
  Top 0.254: U1.D6 79.68,62.48 70.6,53.4 70.6,52.8 v70.9,52.5 71.2,52.2 71.2,50.9 70.6,50.3 70.6,47.1 72.5,45.2 U3.10 | JP5.12 61.08,8.58 62.5,10 64.5,10 65.5,9 74.5,9 75.5,10 88,10 89.08,8.92 JP8.12
  Bottom 0.254: v70.9,52.5 67.5,52.5 67.4,52.6 66.7,52.6 66.05,51.95 47.75,51.95 43.5,47.7 43.5,13 45,11.5 48.5,11.5 50,10 51.21,10 52.2,9.02 52.2,4.8 53,4 58.8,4 59.8,5 59.8,6.3 61.08,7.58 JP5.12
D7/RFID_SS_1  (via drill 0.5)
  Top 0.254: U3.11 72.4,44.7 70.1,47 70.1,51.4 | 70.1,51.4 70.1,53.5 77.14,60.54 U1.D7 | v70.4,51.4 70.1,51.4 | v50.25,11 50.25,12.25 v48.75,13.75
  Bottom 0.254: v70.4,51.4 69.5,51.4 68.3,50.2 67.6,50.2 66.8,49.4 66.1,49.4 65.5,50 48.6,50 45.5,46.9 45.5,14 46,13.5 48.5,13.5 v48.75,13.75 | JP5.7 54.74,6.87 54.74,6.99 54.74,7.37 54.74,9.5 54.24,10 52,10 51.25,10.75 50.5,10.75 v50.25,11
D8/RFID_SS_2  (via drill 0.5)
  Top 0.254: U3.12 72.3,44.2 70.7,45.8 | 70.7,45.8 69.6,46.9 69.6,61.8 73.08,65.28 U1.D8 | v70.45,45.55 70.7,45.8
  Bottom 0.254: v70.45,45.55 68.5,43.6 68.5,33.2 56.5,21.2 56.5,14.5 57.5,13.5 61,13.5 62,12.5 79.19,12.5 82.74,8.95 82.74,7.81 82.74,6.99 82.74,6.86 JP8.7
D9
  Top 0.254: U3.13 72.2,43.7 71.4,44.5 70.2,44.5 69.7,45 69.7,46.2 69.1,46.8 69.1,62 70.54,63.44 U1.D9
D10/ETHERNER_SS
  Top 0.254: U3.14 72,43.2 71.5,43.7 70.4,43.7 69.2,44.9 69.2,46.1 68.6,46.7 68.6,61.8 68,62.4 U1.D10
D11/MOSI  (via drill 0.5)
  Top 0.254: U3.15 v71.3,42.7 70.8,42.7 68.7,44.8 68.7,46 68.1,46.6 68.1,51 | 68.1,51 68.1,61.7 65.46,64.34 U1.D11 | v67.8,51 68.1,51 | JP5.9 58.54,4.46 59.5,3.5 86,3.5 v86.25,3.25
  Bottom 0.254: v67.8,51 48.2,51 44.5,47.3 44.5,13.5 45.5,12.5 51.25,12.5 52.75,11 57.83,11 59.82,9.02 59.82,7.62 58.54,6.34 JP5.9 | U1.MOSI 97.59,43.89 96.4,42.7 87.2,42.7 81.2,36.7 75.2,36.7 71.3,40.6 v71.3,42.7 | JP8.9 86.25,5.31 v86.25,3.25
D12/MISO  (via drill 0.5)
  Top 0.254: U3.16 72.8,42.2 v72.5,41.9 71,41.9 68.2,44.7 68.2,45.9 67.6,46.5 67.6,50 67,50.6 v67,51.8 67.6,52.4 67.6,61.6 62.92,66.28 U1.D12 | JP5.10 58.54,9.54 59.5,10.5 64.75,10.5 65.75,9.5 74.25,9.5 75.25,10.5 86,10.5 v86.25,10.75
  Bottom 0.254: v67,51.8 66.7,51.5 48,51.5 44,47.5 44,13.25 45.25,12 51,12 52.5,10.5 57.58,10.5 58.54,9.54 JP5.10 | U1.MISO 95.05,46.35 92.4,43.7 87,43.7 81,37.7 75.5,37.7 72.9,40.3 72.9,41.5 v72.5,41.9 | v86.25,10.75 86.25,9.5 86.25,8.96 86.25,8.69 JP8.10
D13/SCK  (via drill 0.5)
  Top 0.254: U1.D13 60.38,66.02 61.8,64.6 64,64.6 67.1,61.5 67.1,53 66.2,52.1 66.2,50.4 v66.4,50.2 67.1,49.5 67.1,46.4 67.7,45.8 67.7,44.6 71.2,41.1 72.1,41.1 | U3.17 73.4,41.55 72.95,41.1 72.1,41.1 | v72.1,40.9 72.1,41.1 | JP5.11 61.08,5.42 62.5,4 88,4 89.08,5.08 JP8.11
  Bottom 0.254: v66.4,50.2 66.1,50.5 48.4,50.5 45,47.1 45,13.75 45.75,13 51.75,13 53.25,11.5 60,11.5 62.36,9.14 62.36,6.88 JP5.11 | U1.SCK 93.24,43.94 92.5,43.2 87.1,43.2 81.1,37.2 75.3,37.2 72.1,40.4 v72.1,40.9
DTR
  Top 0.254: JP6.6 90.8,61.5 C29.2
FTDI_PWR  (1 unrouted)
  Top 0.406: C38.2 91.3,54.38 JP6.3
GND  (via drill 0.5)
  Top 0.254: U3.5 76.75,44.2 U3.PAD | U3.PAD 77.75,44.7 U3.3 | U3.21 77.25,43.95 U3.PAD
  other vias: 77,43.95 76.1,43.05 77.9,43.05 77.9,44.85 76.1,44.85 77.5,49.95 73.8,40.7 82.6,41.5 83.4,43.1 73.8,51.2 82.4,47.9 82.5,51.8 65.2,43.8 65.2,49.1 66.2,53.5 50.6,53.3 46.8,45.1 53,38.7 46.7,38 53.7,32.4 58.9,32.1 55.4,24.9 63.3,25.8 58.7,27.6 65.5,25.9 63.2,23.5 65.4,23.5 79.7,18.4 74.1,32.4 70.7,37.1 70.1,40.5 60,42.1 58.4,60.2 73.7,59.8 75.7,54.1 84.9,58.2 94.8,62 96.55,49.2 91.1,37.6 94.5,27.5 38.5,26.1 42.5,13.2 35.1,31.3 34,33 38.3,65.8 46.5,60.8 34.6,40.4 72.7,53.2 81.7,54.4 66.1,46.3 5,50 10,50 15,50 19,50 23.25,49.5 10,28 14,28 30,52 49,57 89,46 98,33 91,32 80,23 75,28 69,27 71,23 63,35 63,40 54,28 49,28 46.25,28 42.25,23.75 26.25,29.75 19,37.75 46.25,23.75 5,45 5,40 5,35 5,30 5,25 5,15 5,10 5,5 10,5 15,5 20,5 25,5 30,5 35,5 40,5 40,10 40,20 50,20 40,35 40,40 15,40 15,45 10,45 10,40 20,40 20,45 25,40 25,45 30,45 30,40 35,35 40,45 35,45 45,10 50,25 90,15 90,10 82.5,12.5 67.5,5 72.5,7.5 30,17.5 30,26 30,28 34,28 52,3.5 72.5,5 70.5,1 89.5,3.5 71,13.5 64,13.5 65.9,10.5 68.3,10.5 71,10.5 51,14 51,17 36.5,22 33.5,15.5 37.5,13
  pour Bottom: 0,1 arc90 1,0 96.46,0 arc90 97.46,1 97.46,18.54 100,21.1 100,53.85 97.46,56.39 97.46,67.82 95.94,69.34 31,69.34 arc90 29,67.34 29,54 arc-90 27,52 2,52 arc90 0,50
  pour Top: 95.94,69.34 31,69.34 arc90 29,67.34 29,54 arc-90 27,52 2,52 arc90 0,50 0,1 arc90 1,0 96.46,0 arc90 97.46,1 97.46,18.54 100,21.1 100,53.85 97.46,56.39 97.46,67.82
MAG_RELAY
  Top 0.254: Q3.1 17.77,35.12 18.32,35.12 18.35,35.15 18.5,35.3 18.7,35.5 R4.2 22.41,35.5 JP10.2 30.04,35.96 32.63,33.37 IC2.4
N$2
  Top 0.254: Q3.3 D3.A 14.5,35 14.5,33 16.8,30.7 K1.2
N$3
  Top 0.254: Q1.1 75.75,48.06 U3.7
N$4
  Top 0.254: Q1.3 73,48.81 73,47.5 74.15,46.35 U3.8
NC
  Bottom 1.016: JP3.1 17.5,17.2 K1.O
NO
  Bottom 1.016: JP3.3 7.5,17.2 K1.S
P1
  Top 0.254: IC2.5 31.36,31.64 29.58,33.42 JP10.3
P2
  Top 0.254: IC2.6 30.09,30.66 29.25,31.5 27,31.5 26.38,30.88 JP10.4
P3
  Top 0.254: JP10.5 24.66,28.34 25.5,27.5 28,27.5 28.82,28.32 IC2.7
P4
  Top 0.254: JP10.6 26,25.8 IC2.9
P5
  Top 0.254: JP10.7 26.24,23.26 26.5,23 28.5,23 28.82,23.32 IC2.10
P6
  Top 0.254: IC2.11 30.09,22.09 28.72,20.72 JP10.8
P7
  Top 0.254: JP10.9 28.68,18.18 31.36,20.86 IC2.12
RX_FTDI
  Top 0.254: JP6.4 90.88,56.5 R32.1
TX_FTDI
  Top 0.254: JP6.5 90.84,59 R31.1
VCC  (via drill 0.5)  (1 unrouted)
  Top 0.254: U3.18 C6.2 v75.75,39.05 | C1.2 76.47,48.9 76.5,48.9 | 76.75,47.6 77.25,47.1 U3.4 | 76.75,47.6 76.25,47.1 U3.6 | 76.75,47.6 76.75,48.52 76.4,48.87 | 76.4,48.87 76.43,48.9 | 76.4,48.87 v76.4,50 | R3.2 v84.2,44.2
  Top 0.406: v75.75,39.05 75.4,38.7 73.97,38.7 L1.2
  Bottom 0.254: v84.2,44.2 81.4,44.2
  Bottom 0.406: v76.4,50 77.5,51.1 79.8,51.1 81.4,49.5 81.4,44.2 81.4,41.8 78.65,39.05 v75.75,39.05
VIN
  Top 0.254: C2.1 41,63.35 41.1,63.45
  Top 0.406: C8.+ 41.1,63.45 38.05,63.45 JP2.3
  Top 0.813: U1.VIN 77.14,23.1 75.64,24.6 59.5,24.6 57.2,26.9 57.2,40.61 U2.1 54.31,43.5 45.31,43.5 U7.1
  Bottom 0.813: JP2.3 32.1,62.6 32.1,55.3 35.7,51.7 37.8,51.7 39.81,49.69 U7.1

### Text on the board
tPlace: VIN | DTR | TX | GND | RX | 5V0 | FTDI | 5V0 | CTS | GND | (Mag) 5V0 | 3V3 | 1 | 3V3 PowerPOD | 5V0 | ISP | 5V0 (Mag) | P0* | 5V0 PowerPOD | P1 | P2 | P3 | 5V0 PowerPOD | P4 | P5 | v2.0 | P6 | P7 | GND | Outside | Inside | NC | NO | COM | NC | Relay | GND | Hall | HSNOTTS Gatekeeper